# EAGLE design Groovegrid_pwr (EAGLE 9.6.1)
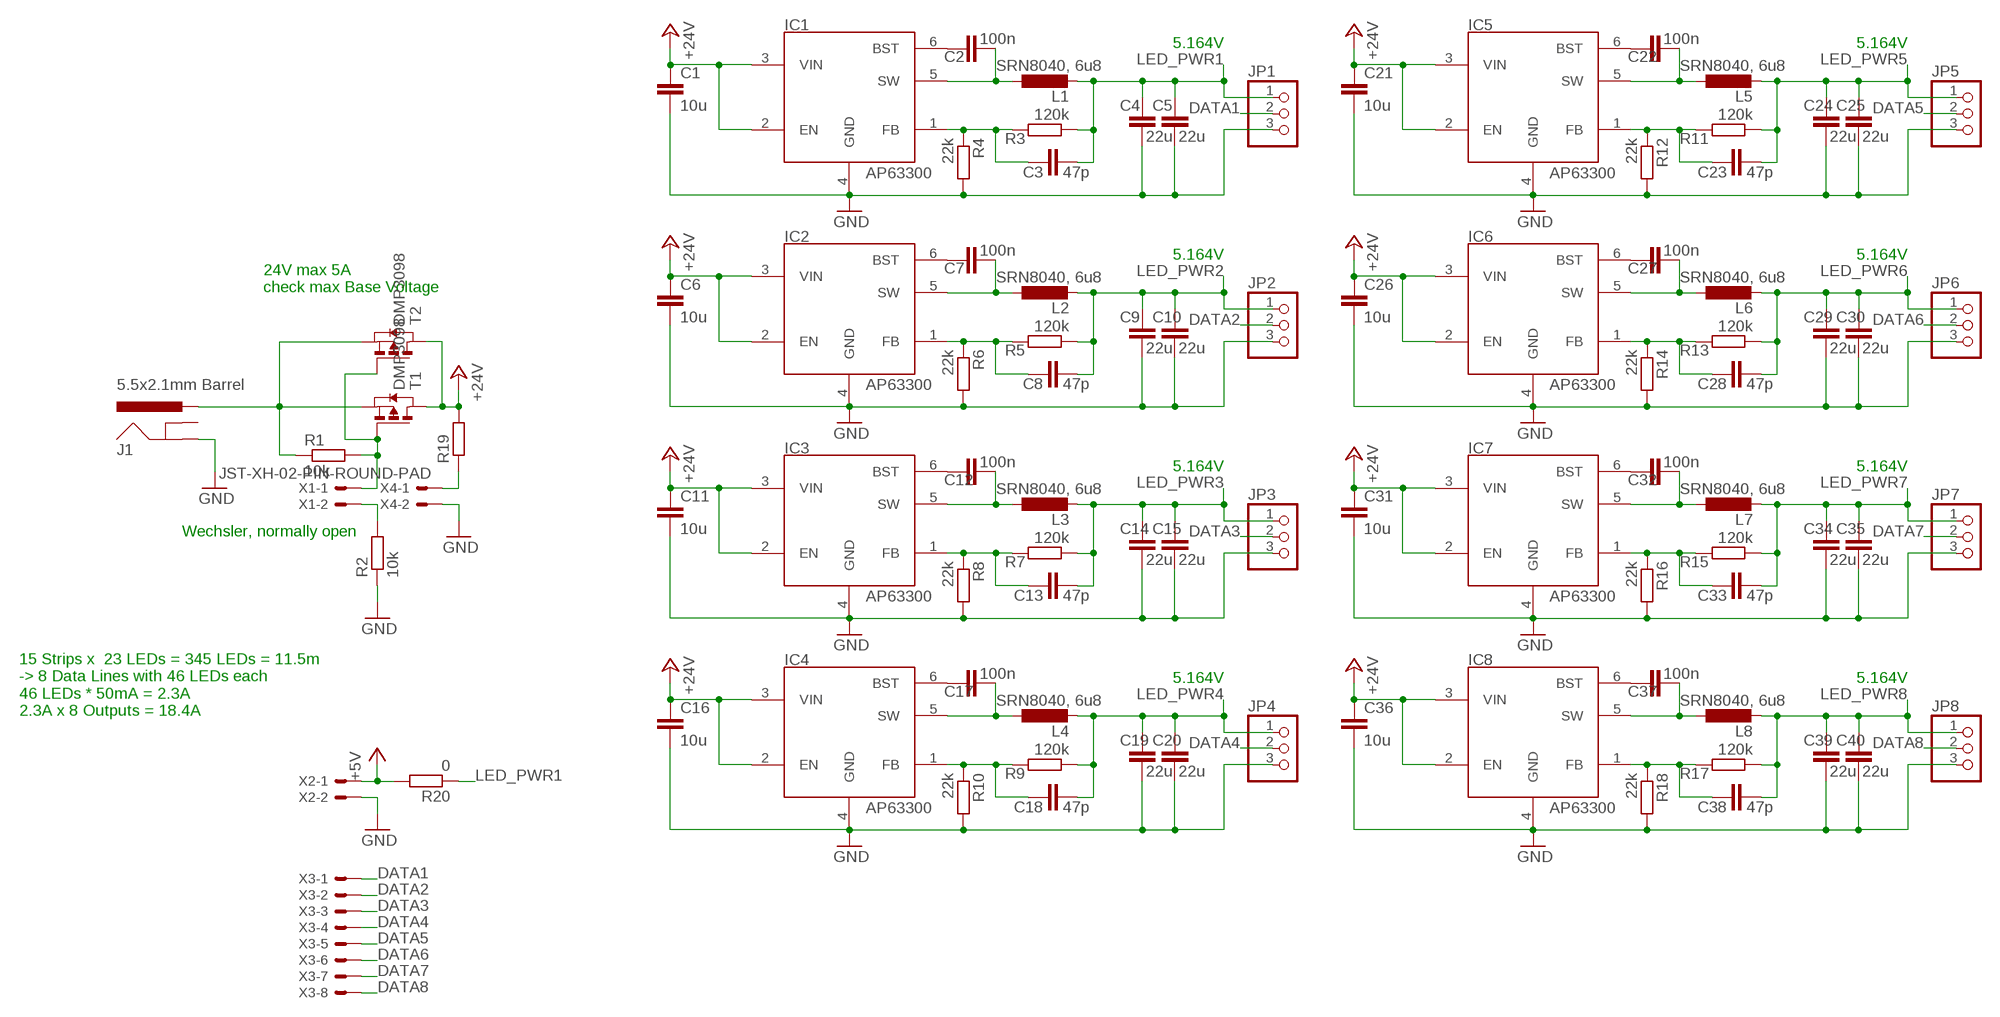
[diagram p0: schematic, sheet 1]

## Parts
C1  10u  C-EUC1206  [C1206]
C2  100n  C-EUC0805  [C0805]
C3  47p  C-EUC0805  [C0805]
C4  22u  C-EUC1206  [C1206]
C5  22u  C-EUC1206  [C1206]
C6  10u  C-EUC1206  [C1206]
C7  100n  C-EUC0805  [C0805]
C8  47p  C-EUC0805  [C0805]
C9  22u  C-EUC1206  [C1206]
C10  22u  C-EUC1206  [C1206]
C11  10u  C-EUC1206  [C1206]
C12  100n  C-EUC0805  [C0805]
C13  47p  C-EUC0805  [C0805]
C14  22u  C-EUC1206  [C1206]
C15  22u  C-EUC1206  [C1206]
C16  10u  C-EUC1206  [C1206]
C17  100n  C-EUC0805  [C0805]
C18  47p  C-EUC0805  [C0805]
C19  22u  C-EUC1206  [C1206]
C20  22u  C-EUC1206  [C1206]
C21  10u  C-EUC1206  [C1206]
C22  100n  C-EUC0805  [C0805]
C23  47p  C-EUC0805  [C0805]
C24  22u  C-EUC1206  [C1206]
C25  22u  C-EUC1206  [C1206]
C26  10u  C-EUC1206  [C1206]
C27  100n  C-EUC0805  [C0805]
C28  47p  C-EUC0805  [C0805]
C29  22u  C-EUC1206  [C1206]
C30  22u  C-EUC1206  [C1206]
C31  10u  C-EUC1206  [C1206]
C32  100n  C-EUC0805  [C0805]
C33  47p  C-EUC0805  [C0805]
C34  22u  C-EUC1206  [C1206]
C35  22u  C-EUC1206  [C1206]
C36  10u  C-EUC1206  [C1206]
C37  100n  C-EUC0805  [C0805]
C38  47p  C-EUC0805  [C0805]
C39  22u  C-EUC1206  [C1206]
C40  22u  C-EUC1206  [C1206]
IC1  AP63300  [SOT23-6]
IC2  AP63300  [SOT23-6]
IC3  AP63300  [SOT23-6]
IC4  AP63300  [SOT23-6]
IC5  AP63300  [SOT23-6]
IC6  AP63300  [SOT23-6]
IC7  AP63300  [SOT23-6]
IC8  AP63300  [SOT23-6]
J1  5.5x2.1mm Barrel  POWER_JACKSMD  [POWER_JACK_SMD]
JP1  PINHD-1X3  [1X03]
JP2  PINHD-1X3  [1X03]
JP3  PINHD-1X3  [1X03]
JP4  PINHD-1X3  [1X03]
JP5  PINHD-1X3  [1X03]
JP6  PINHD-1X3  [1X03]
JP7  PINHD-1X3  [1X03]
JP8  PINHD-1X3  [1X03]
L1  SRN8040, 6u8  SRN8040  [SRN8040]
L2  SRN8040, 6u8  SRN8040  [SRN8040]
L3  SRN8040, 6u8  SRN8040  [SRN8040]
L4  SRN8040, 6u8  SRN8040  [SRN8040]
L5  SRN8040, 6u8  SRN8040  [SRN8040]
L6  SRN8040, 6u8  SRN8040  [SRN8040]
L7  SRN8040, 6u8  SRN8040  [SRN8040]
L8  SRN8040, 6u8  SRN8040  [SRN8040]
R1  10k  R-EU_R0805  [R0805]
R2  10k  R-EU_R0805  [R0805]
R3  120k  R-EU_R0805  [R0805]
R4  22k  R-EU_R0805  [R0805]
R5  120k  R-EU_R0805  [R0805]
R6  22k  R-EU_R0805  [R0805]
R7  120k  R-EU_R0805  [R0805]
R8  22k  R-EU_R0805  [R0805]
R9  120k  R-EU_R0805  [R0805]
R10  22k  R-EU_R0805  [R0805]
R11  120k  R-EU_R0805  [R0805]
R12  22k  R-EU_R0805  [R0805]
R13  120k  R-EU_R0805  [R0805]
R14  22k  R-EU_R0805  [R0805]
R15  120k  R-EU_R0805  [R0805]
R16  22k  R-EU_R0805  [R0805]
R17  120k  R-EU_R0805  [R0805]
R18  22k  R-EU_R0805  [R0805]
R19  R-EU_R0805  [R0805]
R20  0  R-EU_R0805  [R0805]
T1  DMP3098  PMOSSOT23  [SOT23-3]
T2  DMP3098  PMOSSOT23  [SOT23-3]
X1  JST-XH-02-PIN-ROUND-PAD  [JST-XH-02-PACKAGE-ROUND-PAD]
X2  JST-XH-02-PIN-ROUND-PAD  [JST-XH-02-PACKAGE-ROUND-PAD]
X3  JST-XH-08-PIN-ROUND-PAD  [JST-XH-08-PACKAGE-ROUND-PAD]
X4  JST-XH-02-PIN-ROUND-PAD  [JST-XH-02-PACKAGE-ROUND-PAD]

## Nets
+5V: R20.2 X2.1
+24V: C1.1 C6.1 C11.1 C16.1 C21.1 C26.1 C31.1 C36.1 IC1.2(EN) IC1.3(VIN) IC2.2(EN) IC2.3(VIN) IC3.2(EN) IC3.3(VIN) IC4.2(EN) IC4.3(VIN) IC5.2(EN) IC5.3(VIN) IC6.2(EN) IC6.3(VIN) IC7.2(EN) IC7.3(VIN) IC8.2(EN) IC8.3(VIN) R19.2 T1.3(D) T2.3(D)
DATA1: JP1.2 X3.1
DATA2: JP2.2 X3.2
DATA3: JP3.2 X3.3
DATA4: JP4.2 X3.4
DATA5: JP5.2 X3.5
DATA6: JP6.2 X3.6
DATA7: JP7.2 X3.7
DATA8: JP8.2 X3.8
GND: C1.2 C4.2 C5.2 C6.2 C9.2 C10.2 C11.2 C14.2 C15.2 C16.2 C19.2 C20.2 C21.2 C24.2 C25.2 C26.2 C29.2 C30.2 C31.2 C34.2 C35.2 C36.2 C39.2 C40.2 IC1.4(GND) IC2.4(GND) IC3.4(GND) IC4.4(GND) IC5.4(GND) IC6.4(GND) IC7.4(GND) IC8.4(GND) J1.VIN- JP1.3 JP2.3 JP3.3 JP4.3 JP5.3 JP6.3 JP7.3 JP8.3 R2.1 R4.2 R6.2 R8.2 R10.2 R12.2 R14.2 R16.2 R18.2 X2.2 X4.2
LED_PWR1: C3.2 C4.1 C5.1 JP1.1 L1.P$2 R3.1 R20.1
LED_PWR2: C8.2 C9.1 C10.1 JP2.1 L2.P$2 R5.1
LED_PWR3: C13.2 C14.1 C15.1 JP3.1 L3.P$2 R7.1
LED_PWR4: C18.2 C19.1 C20.1 JP4.1 L4.P$2 R9.1
LED_PWR5: C23.2 C24.1 C25.1 JP5.1 L5.P$2 R11.1
LED_PWR6: C28.2 C29.1 C30.1 JP6.1 L6.P$2 R13.1
LED_PWR7: C33.2 C34.1 C35.1 JP7.1 L7.P$2 R15.1
LED_PWR8: C38.2 C39.1 C40.1 JP8.1 L8.P$2 R17.1
N$1: C7.1 IC2.6(BST)
N$2: J1.VIN+0(VIN+) J1.VIN+1(VIN+) R1.1 T1.2(S) T2.2(S)
N$3: C7.2 IC2.5(SW) L2.P$1
N$4: R1.2 T1.1(G) T2.1(G) X1.1
N$5: C8.1 IC2.1(FB) R5.2 R6.1
N$6: R2.2 X1.2
N$7: C2.1 IC1.6(BST)
N$8: C2.2 IC1.5(SW) L1.P$1
N$9: C3.1 IC1.1(FB) R3.2 R4.1
N$10: C12.1 IC3.6(BST)
N$11: C12.2 IC3.5(SW) L3.P$1
N$12: C13.1 IC3.1(FB) R7.2 R8.1
N$13: C17.1 IC4.6(BST)
N$14: C17.2 IC4.5(SW) L4.P$1
N$15: C18.1 IC4.1(FB) R9.2 R10.1
N$16: C22.1 IC5.6(BST)
N$17: C22.2 IC5.5(SW) L5.P$1
N$18: C23.1 IC5.1(FB) R11.2 R12.1
N$19: C27.1 IC6.6(BST)
N$20: C27.2 IC6.5(SW) L6.P$1
N$21: C28.1 IC6.1(FB) R13.2 R14.1
N$22: C32.1 IC7.6(BST)
N$23: C32.2 IC7.5(SW) L7.P$1
N$24: C33.1 IC7.1(FB) R15.2 R16.1
N$25: C37.1 IC8.6(BST)
N$26: C37.2 IC8.5(SW) L8.P$1
N$27: C38.1 IC8.1(FB) R17.2 R18.1
N$29: R19.1 X4.1
Unconnected: J1.DET

## Notes on the sheet
- 5.164V | 5.164V
- 5.164V | 5.164V
- 24V max 5A
  check max Base Voltage
- 5.164V | 5.164V
- Wechsler, normally open
- 5.164V | 5.164V
- 15 Strips x  23 LEDs = 345 LEDs = 11.5m
  -> 8 Data Lines with 46 LEDs each
  46 LEDs * 50mA = 2.3A
  2.3A x 8 Outputs = 18.4A

## Library data of the parts
C1-C40 = resistor:C-EU: CAPACITOR, European symbol
IC1-IC8 = philmalessa:AP63300
J1 = philmalessa:POWER_JACK: Power Jack Connector This is the standard 5.5mm barrel jack for power. The PTH is the most common, proven, reliable, footprint. The Slot footprint only works if the mill layer is transmitted to the PCB fab house so be warned. Here are the connectors we sell at SparkFun: DC Barrel Power Jack/Connector <https://www.sparkfun.com/products/119> (PRT-00119) DC Barrel Power Jack/Connector (SMD) <https://www.sparkfun.com/products/12748> (PRT-12748) DC Barrel Jack Adapter - Breadboard Compatible <https://www.sparkfun.com/products/10811> (PRT-10811) It is used on this SparkFun product (and many, many others): SparkFun RedBoard - Programmed with Arduino <https://www.sparkfun.com/products/12757> (DEV-12757) Also, if you need a mating power supply or connector, please check these out: Wall Adapter Power Supply - 9VDC 650mA <https://www.sparkfun.com/products/298> (TOL-00298) DC Barrel Jack Adapter - Male <https://www.sparkfun.com/products/10287> (PRT-10287); PROD_ID: CONN-08106; SF_ID: PRT-12748
JP1-JP8 = pinhead:PINHD-1X3: PIN HEADER
L1-L8 = philmalessa:SRN8040
R1-R20 = resistor:R-EU_: RESISTOR, European symbol
T1 T2 = philmalessa:PMOSSOT23: MOS FET
X1 X2 X4 = Panda:JST-XH-02-PIN: JST XH Connector 2 Pin Wire to board connector. Pitch: 2,54 mm, (0.100") Number of pins: 2 Created by Rembrandt Electronics www.rembrandtelectronics.com
X3 = Panda:JST-XH-08-PIN: JST XH Connector 2 Pin Wire to board connector. Pitch: 2,54 mm, (0.100") Number of pins: 8 Created by Rembrandt Electronics www.rembrandtelectronics.com

## Board
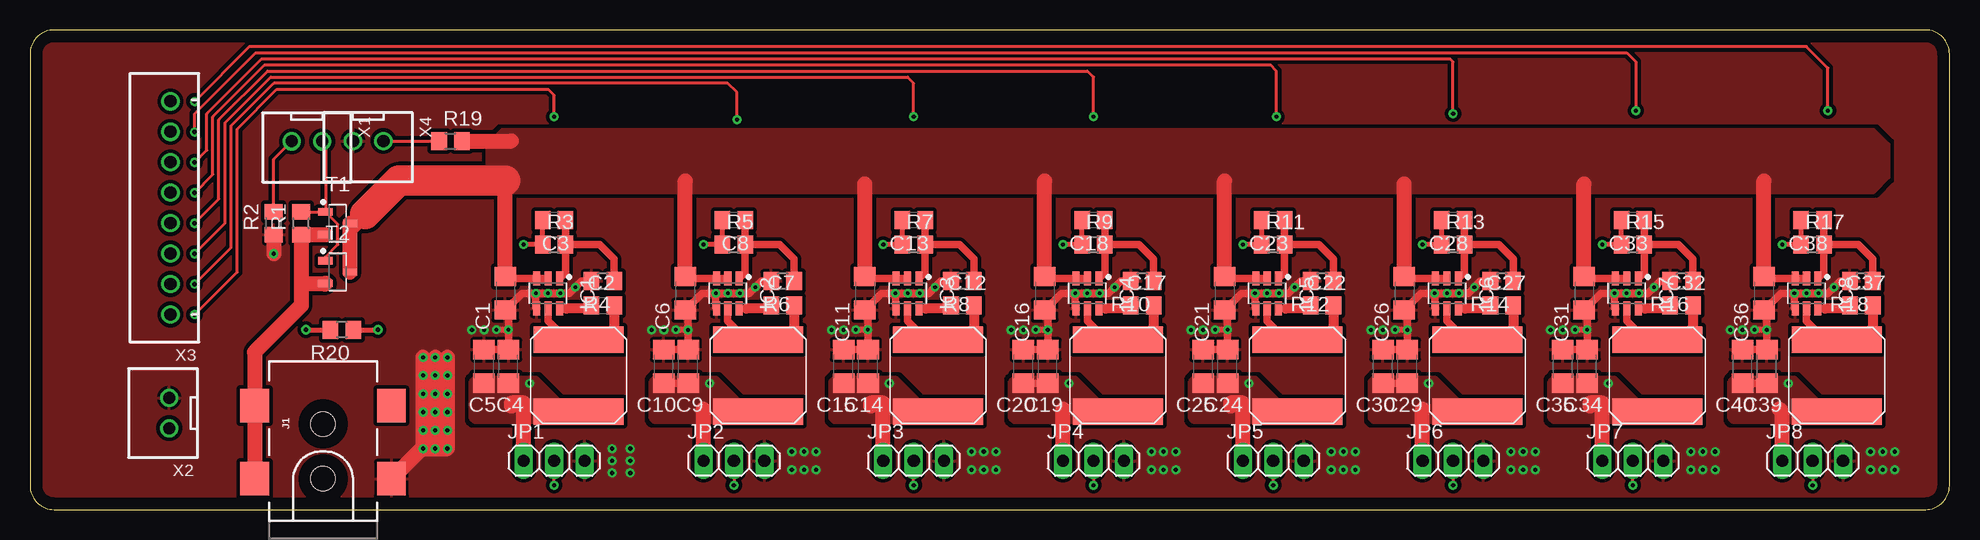
[diagram p1: board, top side]
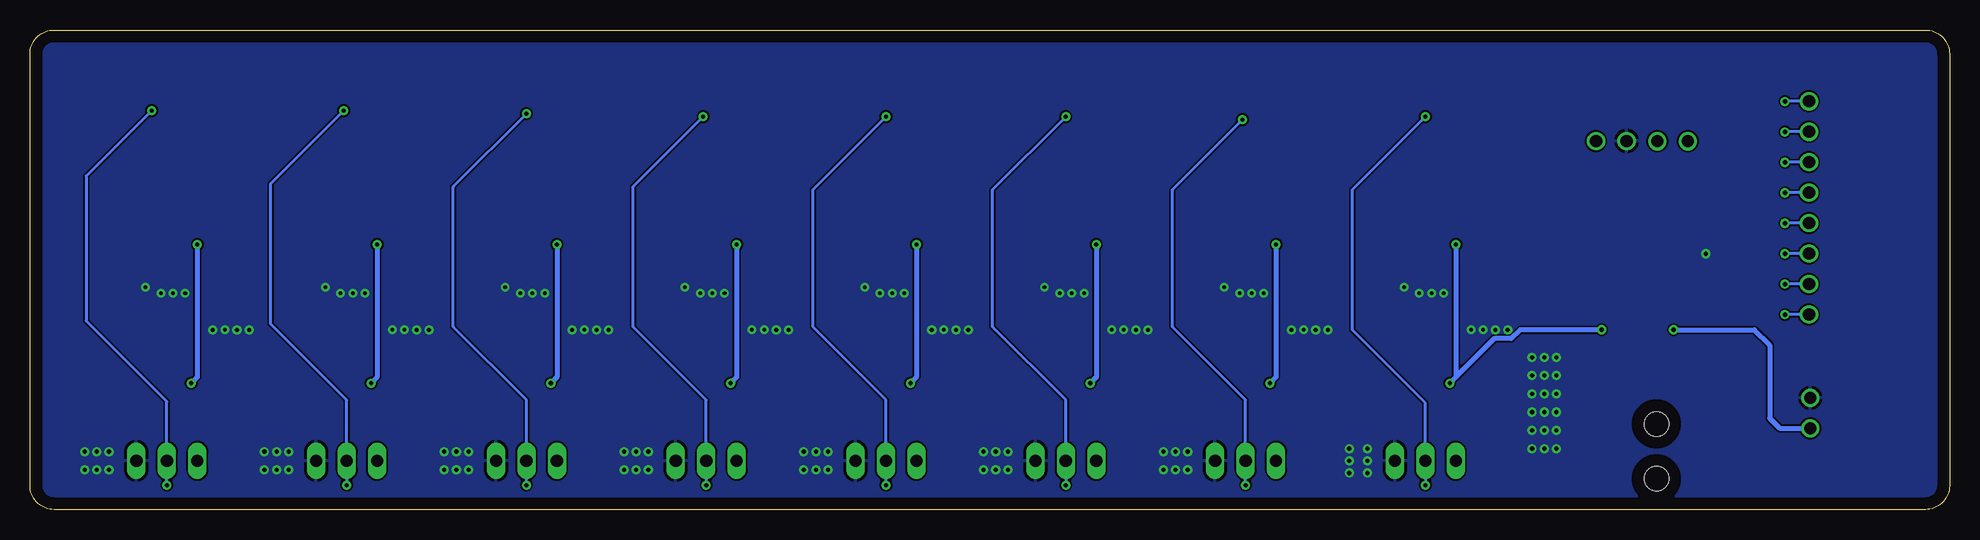
[diagram p2: board, bottom side, seen from below]

Size 160 x 40 mm. Coordinates in mm from the lower left corner, seen from the top.
Outline: 0,38 0,2 arc90 2,0 158,0 arc90 160,2 160,38 arc90 158,40 2,40 arc90 0,38
Copper layers (1*16): Top 0.035mm / dielectric 1.5mm / Bottom 0.035mm
Design rules "default": minimum track width 6mil, minimum drill 0.35mm, track to track 6mil, track to pad 6mil, pad to pad 6mil, via to via 6mil, smd to smd 6mil, copper to edge 40mil, drill to drill 6mil, minimum pad ring 10mil, minimum via ring 8mil, stop-mask expansion 4mil, vias tented up to drill 0mil, thermal gap 10mil

### Footprints (pad centres in the part's own frame; a part is rotated, then mirrored left to right if it is on the bottom)
C1206 = smd 1.6 x 1.8: 1 -1.4,0; 2 1.4,0
C0805 = smd 1.3 x 1.5: 1 -0.95,0; 2 0.95,0
SOT23-6 = smd 1.171 x 0.589: 1 -1.25,0.95; 2 -1.25,0; 3 -1.25,-0.95; 4 1.25,-0.95; 5 1.25,0; 6 1.25,0.95
POWER_JACK_SMD = smd 2.8 x 2.4: DET 6.1,-5.7; VIN+0 0,5.7; VIN+1 6.1,5.7; VIN- 0,-5.7 | hole 2.032: 0,0; 4.572,0
1X03 = drill 1.016 long: 1 -2.54,0; 2 0,0; 3 2.54,0
SRN8040 = smd 2.2 x 7.5: P$1 -3,0; P$2 3,0
R0805 = smd 1.3 x 1.5: 1 -0.95,0; 2 0.95,0
SOT23-3 = smd 1.18 x 0.609: 1 -1.024,0.95; 2 -1.024,-0.95; 3 1.024,0
JST-XH-02-PACKAGE-ROUND-PAD = drill 1.016: 1 -1.27,0; 2 1.27,0
JST-XH-08-PACKAGE-ROUND-PAD = drill 1.016: 1 -8.89,0; 2 -6.35,0; 3 -3.81,0; 4 -1.27,0; 5 1.27,0; 6 3.81,0; 7 6.35,0; 8 8.89,0

### Placement (x,y rotation side)
C1  39.62,18.03 270 top
C2  47.75,17.02 0 top
C3  43.69,24.13 180 top
C4  39.88,11.94 90 top
C5  37.85,11.94 90 top
C6  54.61,18.03 270 top
C7  62.74,17.02 0 top
C8  58.67,24.13 180 top
C9  54.86,11.94 90 top
C10  52.83,11.94 90 top
C11  69.6,18.03 270 top
C12  77.72,17.02 0 top
C13  73.66,24.13 180 top
C14  69.85,11.94 90 top
C15  67.82,11.94 90 top
C16  84.58,18.03 270 top
C17  92.71,17.02 0 top
C18  88.65,24.13 180 top
C19  84.84,11.94 90 top
C20  82.8,11.94 90 top
C21  99.57,18.03 270 top
C22  107.7,17.02 0 top
C23  103.63,24.13 180 top
C24  99.82,11.94 90 top
C25  97.79,11.94 90 top
C26  114.55,18.03 270 top
C27  122.68,17.02 0 top
C28  118.62,24.13 180 top
C29  114.81,11.94 90 top
C30  112.78,11.94 90 top
C31  129.54,18.03 270 top
C32  137.67,17.02 0 top
C33  133.6,24.13 180 top
C34  129.79,11.94 90 top
C35  127.76,11.94 90 top
C36  144.53,18.03 270 top
C37  152.65,17.02 0 top
C38  148.59,24.13 180 top
C39  144.78,11.94 90 top
C40  142.75,11.94 90 top
IC1  43.18,18.03 270 top
IC2  58.17,18.03 270 top
IC3  73.15,18.03 270 top
IC4  88.14,18.03 270 top
IC5  103.12,18.03 270 top
IC6  118.11,18.03 270 top
IC7  133.1,18.03 270 top
IC8  148.08,18.03 270 top
J1  24.43,2.57 90 top
JP1  43.69,4.06 0 top
JP2  58.67,4.06 0 top
JP3  73.66,4.06 0 top
JP4  88.65,4.06 0 top
JP5  103.63,4.06 0 top
JP6  118.62,4.06 0 top
JP7  133.6,4.06 0 top
JP8  148.59,4.06 0 top
L1  45.72,11.18 270 top
L2  60.71,11.18 270 top
L3  75.69,11.18 270 top
L4  90.68,11.18 270 top
L5  105.66,11.18 270 top
L6  120.65,11.18 270 top
L7  135.64,11.18 270 top
L8  150.62,11.18 270 top
R1  22.61,23.88 90 top
R2  20.32,23.88 90 top
R3  43.69,22.1 0 top
R4  47.75,19.05 180 top
R5  58.67,22.1 0 top
R6  62.74,19.05 180 top
R7  73.66,22.1 0 top
R8  77.72,19.05 180 top
R9  88.65,22.1 0 top
R10  92.71,19.05 180 top
R11  103.63,22.1 0 top
R12  107.7,19.05 180 top
R13  118.62,22.1 0 top
R14  122.68,19.05 180 top
R15  133.6,22.1 0 top
R16  137.67,19.05 180 top
R17  148.59,22.1 0 top
R18  152.65,19.05 180 top
R19  35.05,30.73 0 top
R20  26,15 180 top
T1  25.65,23.88 0 top
T2  25.65,19.81 0 top
X1  23.09,30.72 180 top
X2  11.6,8.05 90 top
X3  11.71,25.16 90 top
X4  28.19,30.73 180 top

### Tracks (layer width: path | path; a pad name or v marks a point on that pad's centre or on a via)
+5V  (via drill 0.35)
  Top 0.406: v23,15 R20.2
  Bottom 0.406: v23,15 16.27,15 14.99,13.72 14.99,7.62 14.14,6.78 X2.1
+24V
  Top 0.61: IC1.3 IC1.2 39.77,19.28 C1.1 | IC2.3 IC2.2 54.76,19.28 C6.1 | IC3.3 IC3.2 69.75,19.28 C11.1 | IC4.3 IC4.2 84.73,19.28 C16.1 | IC5.3 IC5.2 99.72,19.28 C21.1 | IC6.3 IC6.2 114.7,19.28 C26.1 | IC7.3 IC7.2 129.69,19.28 C31.1 | IC8.3 IC8.2 144.68,19.28 C36.1
  Top 1.27: C1.1 39.62,27.43 | C6.1 54.61,27.43 | C11.1 69.6,27.18 | C16.1 84.58,27.43 | C21.1 99.57,27.43 | C26.1 114.55,27.18 | C31.1 129.54,27.18 | C36.1 144.53,27.43 | 27.94,24.64 27.18,23.88 | 27.18,23.88 T1.3 | R19.2 40.13,30.73 | T2.3 26.68,23.38 27.18,23.88
  Top 2.54: 27.94,24.64 30.73,27.43 39.62,27.43
  pour Top: 39.37,31.75 153.67,31.75 154.94,30.48 154.94,27.69 153.67,26.42 39.12,26.42 38.1,27.43 38.1,30.48
DATA1  (via drill 0.35)
  Top 0.254: v13.72,16.26 17.27,19.81 17.27,31.75 20.57,35.05 43.18,35.05 43.69,34.54 v43.69,32.77 | v43.69,2.03 JP1.2
  Bottom 0.254: X3.1 13.7,16.27 v13.72,16.26 | v43.69,32.77 49.78,26.67 49.78,14.99 43.69,8.89 JP1.2 v43.69,2.03
DATA2  (via drill 0.35)
  Top 0.254: v13.72,18.8 16.76,21.84 16.76,32 20.32,35.56 58.17,35.56 58.93,34.8 v58.93,32.51 | JP2.2 v58.67,2.03
  Bottom 0.254: X3.2 13.7,18.81 v13.72,18.8 | v58.93,32.51 64.77,26.67 64.77,15.24 58.67,9.14 JP2.2 v58.67,2.03
DATA3  (via drill 0.35)
  Top 0.254: v13.72,21.34 16.26,23.88 16.26,32.26 20.07,36.07 73.15,36.07 73.66,35.56 v73.66,32.77 | v73.66,2.03 JP3.2
  Bottom 0.254: X3.3 13.7,21.35 v13.72,21.34 | v73.66,32.77 79.76,26.67 79.76,15.24 73.66,9.14 JP3.2 v73.66,2.03
DATA4  (via drill 0.35)
  Top 0.254: v13.72,23.88 15.75,25.91 15.75,32.51 19.81,36.58 88.14,36.58 88.65,36.07 v88.65,32.77 | JP4.2 v88.65,2.03
  Bottom 0.254: X3.4 13.7,23.89 v13.72,23.88 | v88.65,32.77 94.74,26.67 94.74,15.24 88.65,9.14 JP4.2 v88.65,2.03
DATA5  (via drill 0.35)
  Top 0.254: v13.72,26.42 15.24,27.94 15.24,32.77 19.56,37.08 103.38,37.08 103.89,36.58 v103.89,32.77 | v103.63,2.03 JP5.2
  Bottom 0.254: X3.5 13.7,26.43 v13.72,26.42 | v103.89,32.77 109.73,26.92 109.73,15.24 103.63,9.14 JP5.2 v103.63,2.03
DATA6  (via drill 0.35)
  Top 0.254: v13.72,28.96 14.73,29.97 14.73,33.02 19.3,37.59 118.36,37.59 118.62,37.34 v118.62,33.02 | JP6.2 v118.62,2.03
  Bottom 0.254: X3.6 13.7,28.97 v13.72,28.96 | v118.62,33.02 124.71,26.92 124.71,15.24 118.62,9.14 JP6.2 v118.62,2.03
DATA7  (via drill 0.35)
  Top 0.254: v13.72,31.5 13.72,33.02 18.8,38.1 133.1,38.1 133.86,37.34 v133.86,33.27 | v133.6,2.03 JP7.2
  Bottom 0.254: X3.7 13.7,31.51 v13.72,31.5 | v133.86,33.27 139.95,27.18 139.95,15.49 133.6,9.14 JP7.2 v133.6,2.03
DATA8  (via drill 0.35)
  Top 0.254: v13.72,34.04 18.29,38.61 148.08,38.61 149.86,36.83 v149.86,33.27 | JP8.2 v148.59,2.03
  Bottom 0.254: X3.8 13.7,34.05 v13.72,34.04 | v149.86,33.27 155.32,27.82 155.32,15.74 148.59,9.01 JP8.2 v148.59,2.03
GND  (via drill 0.3, 0.35)
  Top 0.508: v39.88,14.99 v38.86,14.99 | v54.86,14.99 v53.85,14.99 | v69.85,14.99 v68.83,14.99 | v84.84,14.99 v83.82,14.99 | v99.82,14.99 v98.81,14.99 | v114.81,14.99 v113.79,14.99 | v129.79,14.99 v128.78,14.99 | v144.78,14.99 v143.76,14.99
  Top 0.61: R4.2 45.97,19.05 v45.47,18.54 44.96,18.03 v44.2,18.03 v43.18,18.03 v42.16,18.03 | v42.16,18.03 41.02,18.03 C1.2 39.88,16.38 v39.88,14.99 C4.2 C5.2 | IC1.4 42.16,16.85 v42.16,18.03 | R6.2 60.96,19.05 59.94,18.03 v57.15,18.03 | v57.15,18.03 56.01,18.03 C6.2 54.86,16.38 v54.86,14.99 C9.2 C10.2 | IC2.4 57.15,16.85 v57.15,18.03 | R8.2 75.95,19.05 v75.44,18.54 74.93,18.03 v74.17,18.03 v73.15,18.03 v72.14,18.03 | v72.14,18.03 71,18.03 C11.2 69.85,16.38 v69.85,14.99 C14.2 C15.2 | IC3.4 72.14,16.85 v72.14,18.03 | R10.2 90.93,19.05 89.92,18.03 v87.12,18.03 | v87.12,18.03 85.98,18.03 C16.2 84.84,16.38 v84.84,14.99 C19.2 C20.2 | IC4.4 87.12,16.85 v87.12,18.03 | R12.2 105.92,19.05 v105.41,18.54 104.9,18.03 v104.14,18.03 v103.12,18.03 v102.11,18.03 | v102.11,18.03 100.97,18.03 C21.2 99.82,16.38 v99.82,14.99 C24.2 C25.2 | IC5.4 102.11,16.85 v102.11,18.03 | R14.2 120.9,19.05 119.89,18.03 v117.09,18.03 | v117.09,18.03 115.95,18.03 C26.2 114.81,16.38 v114.81,14.99 C29.2 C30.2 | IC6.4 117.09,16.85 v117.09,18.03 | R16.2 135.89,19.05 v135.38,18.54 134.87,18.03 v134.11,18.03 v133.1,18.03 v132.08,18.03 | v132.08,18.03 130.94,18.03 C31.2 129.79,16.38 v129.79,14.99 C34.2 C35.2 | IC7.4 132.08,16.85 v132.08,18.03 | R18.2 150.88,19.05 149.86,18.03 v147.07,18.03 | v147.07,18.03 145.93,18.03 C36.2 144.78,16.38 v144.78,14.99 C39.2 C40.2 | IC8.4 147.07,16.85 v147.07,18.03
  Top 1.27: J1.VIN- 32.64,5.08 v32.77,5.08 | v32.77,5.08 v33.78,5.08 | v33.78,5.08 v34.8,5.08 v34.8,12.7 | v33.78,5.08 v33.78,12.7 | v32.77,5.08 v32.77,12.7 | R2.1 v20.32,21.34
  other vias: 58.17,18.03 59.18,18.03 60.45,18.54 52.83,14.99 51.82,14.99 37.85,14.99 36.83,14.99 88.14,18.03 89.15,18.03 90.42,18.54 82.8,14.99 81.79,14.99 67.82,14.99 66.8,14.99 118.11,18.03 119.13,18.03 120.4,18.54 112.78,14.99 111.76,14.99 97.79,14.99 96.77,14.99 148.08,18.03 149.1,18.03 150.37,18.54 142.75,14.99 141.73,14.99 127.76,14.99 126.75,14.99 32.77,6.6 33.78,6.6 34.8,6.6 32.77,8.13 33.78,8.13 34.8,8.13 32.77,9.65 33.78,9.65 34.8,9.65 32.77,11.18 33.78,11.18 34.8,11.18 153.42,3.3 154.43,3.3 155.45,3.3 153.42,4.83 154.43,4.83 155.45,4.83 138.43,3.3 139.45,3.3 140.46,3.3 138.43,4.83 139.45,4.83 140.46,4.83 123.44,3.3 124.46,3.3 125.48,3.3 123.44,4.83 124.46,4.83 125.48,4.83 108.46,3.3 109.47,3.3 110.49,3.3 108.46,4.83 109.47,4.83 110.49,4.83 93.47,3.3 94.49,3.3 95.5,3.3 93.47,4.83 94.49,4.83 95.5,4.83 78.49,3.3 79.5,3.3 80.52,3.3 78.49,4.83 79.5,4.83 80.52,4.83 63.5,3.3 64.52,3.3 65.53,3.3 63.5,4.83 64.52,4.83 65.53,4.83 50.04,3.05 50.04,4.06 50.04,5.08 48.51,3.05 48.51,4.06 48.51,5.08
  pour Bottom: 0,40 160,40 160,0 0,0
  pour Top (isolate 0.305, rank 2): 0,40 160,40 160,0 0,0
LED_PWR1  (via drill 0.35)
  Top 0.406: C3.2 R3.1 v41.15,22.1 | R20.1 v29,15
  Top 1.27: JP1.1 41.15,8.89 40.13,8.89 40.13,8.64
  Bottom 0.406: v41.15,22.1 41.15,11.05 | 41.15,11.05 v41.66,10.54 | 41.15,11.05 37.94,14.25 36.53,14.25 35.78,15 v29,15
  pour Top (no thermals): 37.08,10.92 42.16,10.92 44.2,8.89 44.2,7.37 37.08,7.37 36.83,7.62 36.83,10.67
LED_PWR2  (via drill 0.35)
  Top 0.406: C8.2 R5.1 v56.13,22.1
  Top 0.61: C9.1 C10.1
  Top 1.27: JP2.1 56.13,8.38
  Bottom 0.406: v56.13,22.1 56.13,11.05 v56.64,10.54
  pour Top (no thermals): 52.07,10.92 57.15,10.92 59.18,8.89 59.18,7.37 52.07,7.37 51.82,7.62 51.82,10.67
LED_PWR3  (via drill 0.35)
  Top 0.406: C13.2 R7.1 v71.12,22.1
  Top 1.27: JP3.1 71.12,8.89 70.1,8.89 70.1,8.64
  Bottom 0.406: v71.12,22.1 71.12,11.05 v71.63,10.54
  pour Top (no thermals): 67.06,10.92 72.14,10.92 74.17,8.89 74.17,7.37 67.06,7.37 66.8,7.62 66.8,10.67
LED_PWR4  (via drill 0.35)
  Top 0.406: C18.2 R9.1 v86.11,22.1
  Top 0.61: C19.1 C20.1
  Top 1.27: JP4.1 86.11,8.38
  Bottom 0.406: v86.11,22.1 86.11,11.05 v86.61,10.54
  pour Top (no thermals): 82.04,10.92 87.12,10.92 89.15,8.89 89.15,7.37 82.04,7.37 81.79,7.62 81.79,10.67
LED_PWR5  (via drill 0.35)
  Top 0.406: C23.2 R11.1 v101.09,22.1
  Top 1.27: JP5.1 101.09,8.89 100.08,8.89 100.08,8.64
  Bottom 0.406: v101.09,22.1 101.09,11.05 v101.6,10.54
  pour Top (no thermals): 97.03,10.92 102.11,10.92 104.14,8.89 104.14,7.37 97.03,7.37 96.77,7.62 96.77,10.67
LED_PWR6  (via drill 0.35)
  Top 0.406: C28.2 R13.1 v116.08,22.1
  Top 0.61: C29.1 C30.1
  Top 1.27: JP6.1 116.08,8.38
  Bottom 0.406: v116.08,22.1 116.08,11.05 v116.59,10.54
  pour Top (no thermals): 112.01,10.92 117.09,10.92 119.13,8.89 119.13,7.37 112.01,7.37 111.76,7.62 111.76,10.67
LED_PWR7  (via drill 0.35)
  Top 0.406: C33.2 R15.1 v131.06,22.1
  Top 1.27: JP7.1 131.06,8.89 130.05,8.89 130.05,8.64
  Bottom 0.406: v131.06,22.1 131.06,11.05 v131.57,10.54
  pour Top (no thermals): 127,10.92 132.08,10.92 134.11,8.89 134.11,7.37 127,7.37 126.75,7.62 126.75,10.67
LED_PWR8  (via drill 0.35)
  Top 0.406: C38.2 R17.1 v146.05,22.1
  Top 0.61: C39.1 C40.1
  Top 1.27: JP8.1 146.05,8.13 145.8,8.38
  Bottom 0.406: v146.05,22.1 146.05,11.05 v146.56,10.54
  pour Top (no thermals): 141.99,10.92 147.07,10.92 149.1,8.89 149.1,7.37 141.99,7.37 141.73,7.62 141.73,10.67
N$1
  Top 0.406: 59.69,16.76 59.14,16.76 IC2.6
  Top 0.813: 61.55,16.78 C7.1 61.53,16.76 59.69,16.76
N$2
  Top 1.27: 22.61,18.8 R1.1 T1.2 | 22.61,18.8 22.61,17.02 18.73,13.14 J1.VIN+1 J1.VIN+0 | T2.2 24.56,18.8 22.61,18.8
N$3
  Top 0.61: IC2.5 58.17,15.75 59.69,14.22 60.66,14.22 L2.P$1
  Top 0.813: C7.2 63.69,15.17 62.69,14.18 L2.P$1
N$4
  Top 0.254: R1.2 T1.1 | X1.1 24.63,30.45 T1.1 | T2.1 24.63,21.07 25.65,22.1 25.65,23.8 T1.1
N$5
  Top 0.61: C8.1 R5.2 | R5.2 59.62,19.79 IC2.1 | R5.2 62.48,22.1 63.69,20.89 R6.1
N$6
  Top 0.254: R2.2 20.32,29.22 X1.2
N$7
  Top 0.406: 44.7,16.76 44.15,16.76 IC1.6
  Top 0.813: 46.57,16.78 C2.1 46.55,16.76 44.7,16.76
N$8
  Top 0.61: IC1.5 43.18,15.75 44.7,14.22 45.67,14.22 L1.P$1
  Top 0.813: C2.2 48.7,15.17 47.7,14.18 L1.P$1
N$9
  Top 0.61: C3.1 R3.2 | R3.2 44.64,19.79 IC1.1 | R3.2 47.5,22.1 48.7,20.89 R4.1
N$10
  Top 0.406: 74.68,16.76 74.12,16.76 IC3.6
  Top 0.813: 76.54,16.78 C12.1 76.52,16.76 74.68,16.76
N$11
  Top 0.61: IC3.5 73.15,15.75 74.68,14.22 75.64,14.22 L3.P$1
  Top 0.813: C12.2 78.67,15.17 77.68,14.18 L3.P$1
N$12
  Top 0.61: C13.1 R7.2 | R7.2 74.61,19.79 IC3.1 | R7.2 77.47,22.1 78.67,20.89 R8.1
N$13
  Top 0.406: 89.66,16.76 89.11,16.76 IC4.6
  Top 0.813: 91.53,16.78 C17.1 91.51,16.76 89.66,16.76
N$14
  Top 0.61: IC4.5 88.14,15.75 89.66,14.22 90.63,14.22 L4.P$1
  Top 0.813: C17.2 93.66,15.17 92.66,14.18 L4.P$1
N$15
  Top 0.61: C18.1 R9.2 | R9.2 89.6,19.79 IC4.1 | R9.2 92.46,22.1 93.66,20.89 R10.1
N$16
  Top 0.406: 104.65,16.76 104.09,16.76 IC5.6
  Top 0.813: 106.51,16.78 C22.1 106.49,16.76 104.65,16.76
N$17
  Top 0.61: IC5.5 103.12,15.75 104.65,14.22 105.62,14.22 L5.P$1
  Top 0.813: C22.2 108.65,15.17 107.65,14.18 L5.P$1
N$18
  Top 0.61: C23.1 R11.2 | R11.2 104.58,19.79 IC5.1 | R11.2 107.44,22.1 108.65,20.89 R12.1
N$19
  Top 0.406: 119.63,16.76 119.08,16.76 IC6.6
  Top 0.813: 121.5,16.78 C27.1 121.48,16.76 119.63,16.76
N$20
  Top 0.61: IC6.5 118.11,15.75 119.63,14.22 120.6,14.22 L6.P$1
  Top 0.813: C27.2 123.63,15.17 122.63,14.18 L6.P$1
N$21
  Top 0.61: C28.1 R13.2 | R13.2 119.57,19.79 IC6.1 | R13.2 122.43,22.1 123.63,20.89 R14.1
N$22
  Top 0.406: 134.62,16.76 134.07,16.76 IC7.6
  Top 0.813: 136.48,16.78 C32.1 136.46,16.76 134.62,16.76
N$23
  Top 0.61: IC7.5 133.1,15.75 134.62,14.22 135.59,14.22 L7.P$1
  Top 0.813: C32.2 138.62,15.17 137.62,14.18 L7.P$1
N$24
  Top 0.61: C33.1 R15.2 | R15.2 134.55,19.79 IC7.1 | R15.2 137.41,22.1 138.62,20.89 R16.1
N$25
  Top 0.406: 149.61,16.76 149.05,16.76 IC8.6
  Top 0.813: 151.47,16.78 C37.1 151.45,16.76 149.61,16.76
N$26
  Top 0.61: IC8.5 148.08,15.75 149.61,14.22 150.57,14.22 L8.P$1
  Top 0.813: C37.2 153.6,15.17 152.61,14.18 L8.P$1
N$27
  Top 0.61: C38.1 R17.2 | R17.2 149.54,19.79 IC8.1 | R17.2 152.4,22.1 153.6,20.89 R18.1
N$29
  Top 0.254: X4.1 R19.1

### Text on the board
tPrint: GrooveGrid PowerSupply | Version 1.0 - 08/2020 | made by Phil Malessa